# Vivado block design bram_lutwave, xczu28dr-ffvg1517-2-e, Vivado 2020.2
# (continued, part 2 of 4)
current_bd_instance /chan2

# ---- hierarchy /chan2/q_adc_splitter ----
current_bd_instance /chan2/q_adc_splitter
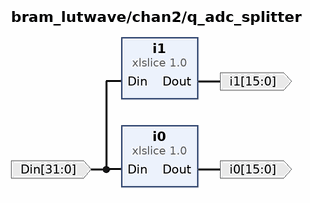
[diagram p13: block diagram inside /chan2/q_adc_splitter]
create_bd_pin -dir I -from 31 -to 0 Din
create_bd_pin -dir O -from 15 -to 0 i0
create_bd_pin -dir O -from 15 -to 0 i1

create_bd_cell -type ip -vlnv xilinx.com:ip:xlslice:1.0 i0
set_property -dict {CONFIG.DIN_FROM 15 CONFIG.DIN_TO 0 CONFIG.DIN_WIDTH 32 CONFIG.DOUT_WIDTH 16} [get_bd_cells i0]
create_bd_cell -type ip -vlnv xilinx.com:ip:xlslice:1.0 i1
set_property -dict {CONFIG.DIN_FROM 31 CONFIG.DIN_TO 16 CONFIG.DIN_WIDTH 32 CONFIG.DOUT_WIDTH 16} [get_bd_cells i1]

# ---- hierarchy /chan2/accum_sync ----
current_bd_instance /chan2/accum_sync
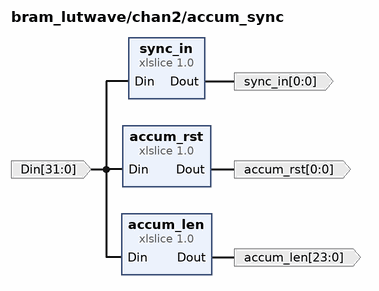
[diagram p14: block diagram inside /chan2/accum_sync]
create_bd_pin -dir I -from 31 -to 0 Din
create_bd_pin -dir O -from 23 -to 0 accum_len
create_bd_pin -dir O -from 0 -to 0 accum_rst
create_bd_pin -dir O -from 0 -to 0 sync_in

create_bd_cell -type ip -vlnv xilinx.com:ip:xlslice:1.0 accum_len
set_property -dict {CONFIG.DIN_FROM 23 CONFIG.DIN_TO 0 CONFIG.DIN_WIDTH 32 CONFIG.DOUT_WIDTH 24} [get_bd_cells accum_len]
create_bd_cell -type ip -vlnv xilinx.com:ip:xlslice:1.0 accum_rst
set_property -dict {CONFIG.DIN_FROM 24 CONFIG.DIN_TO 24 CONFIG.DIN_WIDTH 32 CONFIG.DOUT_WIDTH 1} [get_bd_cells accum_rst]
create_bd_cell -type ip -vlnv xilinx.com:ip:xlslice:1.0 sync_in
set_property -dict {CONFIG.DIN_FROM 26 CONFIG.DIN_TO 26 CONFIG.DIN_WIDTH 32 CONFIG.DOUT_WIDTH 1} [get_bd_cells sync_in]

# ---- hierarchy /chan2/i_adc_splitter ----
current_bd_instance /chan2/i_adc_splitter
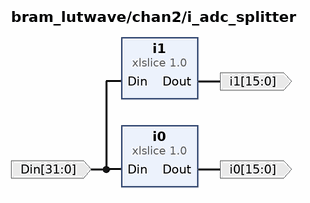
[diagram p15: block diagram inside /chan2/i_adc_splitter]
create_bd_pin -dir I -from 31 -to 0 Din
create_bd_pin -dir O -from 15 -to 0 i0
create_bd_pin -dir O -from 15 -to 0 i1

create_bd_cell -type ip -vlnv xilinx.com:ip:xlslice:1.0 i0
set_property -dict {CONFIG.DIN_FROM 15 CONFIG.DIN_TO 0 CONFIG.DIN_WIDTH 32 CONFIG.DOUT_WIDTH 16} [get_bd_cells i0]
create_bd_cell -type ip -vlnv xilinx.com:ip:xlslice:1.0 i1
set_property -dict {CONFIG.DIN_FROM 31 CONFIG.DIN_TO 16 CONFIG.DIN_WIDTH 32 CONFIG.DOUT_WIDTH 16} [get_bd_cells i1]

# ---- hierarchy /chan2/wide_bram ----
current_bd_instance /chan2/wide_bram
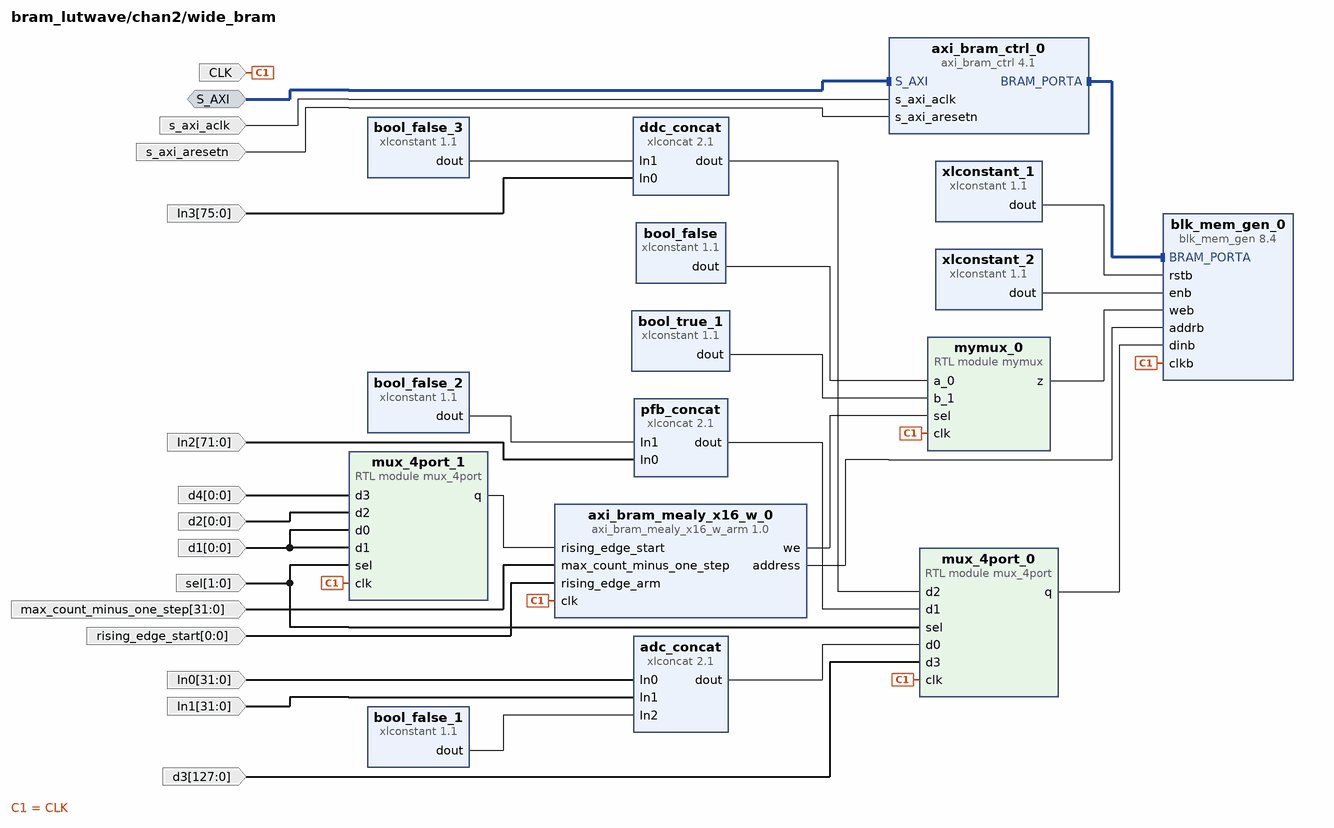
[diagram p16: block diagram inside /chan2/wide_bram]
create_bd_intf_pin -mode Slave -vlnv xilinx.com:interface:aximm_rtl:1.0 S_AXI
create_bd_pin -dir I -type clk s_axi_aclk
create_bd_pin -dir I -type rst s_axi_aresetn
create_bd_pin -dir I -type clk CLK
create_bd_pin -dir I -from 31 -to 0 -type data max_count_minus_one_step
create_bd_pin -dir I -from 0 -to 0 -type data rising_edge_start
create_bd_pin -dir I -from 1 -to 0 sel
create_bd_pin -dir I -from 31 -to 0 In0
create_bd_pin -dir I -from 31 -to 0 In1
create_bd_pin -dir I -from 71 -to 0 In2
create_bd_pin -dir I -from 75 -to 0 In3
create_bd_pin -dir I -from 127 -to 0 d3
create_bd_pin -dir I -from 0 -to 0 d4
create_bd_pin -dir I -from 0 -to 0 d2
create_bd_pin -dir I -from 0 -to 0 d1

create_bd_cell -type ip -vlnv xilinx.com:ip:axi_bram_ctrl:4.1 axi_bram_ctrl_0
set_property -dict {CONFIG.DATA_WIDTH 128 CONFIG.SINGLE_PORT_BRAM 1} [get_bd_cells axi_bram_ctrl_0]
create_bd_cell -type ip -vlnv xilinx.com:ip:xlconstant:1.1 xlconstant_1
set_property -dict {CONFIG.CONST_VAL 0} [get_bd_cells xlconstant_1]
create_bd_cell -type ip -vlnv xilinx.com:ip:xlconstant:1.1 xlconstant_2
set_property -dict {CONFIG.CONST_VAL 1} [get_bd_cells xlconstant_2]
create_bd_cell -type ip -vlnv xilinx.com:ip:blk_mem_gen:8.4 blk_mem_gen_0
set_property -dict [list \
  CONFIG.Enable_32bit_Address true \
  CONFIG.Memory_Type True_Dual_Port_RAM \
  CONFIG.PRIM_type_to_Implement URAM \
  CONFIG.Port_B_Clock 100 \
  CONFIG.Port_B_Enable_Rate 100 \
  CONFIG.Port_B_Write_Rate 50 \
  CONFIG.Use_RSTA_Pin true \
  CONFIG.Use_RSTB_Pin true \
  CONFIG.Write_Depth_A 2048 \
  CONFIG.Write_Width_A 128 \
  CONFIG.use_bram_block Stand_Alone \
] [get_bd_cells blk_mem_gen_0]
create_bd_cell -type ip -vlnv xilinx.com:ip:xlconstant:1.1 bool_false
set_property -dict {CONFIG.CONST_VAL 0 CONFIG.CONST_WIDTH 16} [get_bd_cells bool_false]
create_bd_cell -type ip -vlnv xilinx.com:ip:xlconstant:1.1 bool_true_1
set_property -dict {CONFIG.CONST_VAL 65535 CONFIG.CONST_WIDTH 16} [get_bd_cells bool_true_1]
create_bd_cell -type module -reference mux_4port mux_4port_0
create_bd_cell -type ip -vlnv xilinx.com:ip:xlconcat:2.1 adc_concat
set_property -dict {CONFIG.IN0_WIDTH 32 CONFIG.IN1_WIDTH 32 CONFIG.IN2_WIDTH 64 CONFIG.NUM_PORTS 3} [get_bd_cells adc_concat]
create_bd_cell -type ip -vlnv xilinx.com:ip:xlconstant:1.1 bool_false_1
set_property -dict {CONFIG.CONST_VAL 0 CONFIG.CONST_WIDTH 64} [get_bd_cells bool_false_1]
create_bd_cell -type ip -vlnv xilinx.com:ip:xlconcat:2.1 pfb_concat
set_property -dict {CONFIG.IN0_WIDTH 72 CONFIG.IN1_WIDTH 56 CONFIG.NUM_PORTS 2} [get_bd_cells pfb_concat]
create_bd_cell -type ip -vlnv xilinx.com:ip:xlconstant:1.1 bool_false_2
set_property -dict {CONFIG.CONST_VAL 0 CONFIG.CONST_WIDTH 56} [get_bd_cells bool_false_2]
create_bd_cell -type ip -vlnv xilinx.com:ip:xlconcat:2.1 ddc_concat
set_property -dict {CONFIG.IN0_WIDTH 76 CONFIG.IN1_WIDTH 52 CONFIG.NUM_PORTS 2} [get_bd_cells ddc_concat]
create_bd_cell -type ip -vlnv xilinx.com:ip:xlconstant:1.1 bool_false_3
set_property -dict {CONFIG.CONST_VAL 0 CONFIG.CONST_WIDTH 52} [get_bd_cells bool_false_3]
create_bd_cell -type module -reference mymux mymux_0
set_property -dict {CONFIG.width 16} [get_bd_cells mymux_0]
create_bd_cell -type ip -vlnv User_Company:SysGen:axi_bram_mealy_x16_w_arm:1.0 axi_bram_mealy_x16_w_0
create_bd_cell -type module -reference mux_4port mux_4port_1
set_property -dict {CONFIG.width 1} [get_bd_cells mux_4port_1]

# ---- hierarchy /chan2ts ----
current_bd_instance /chan2ts
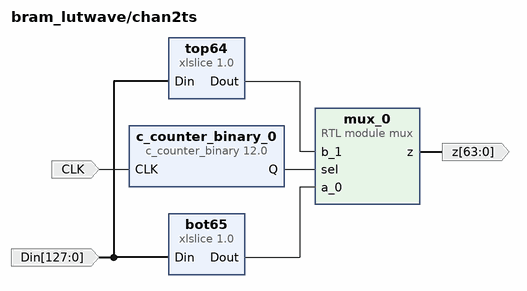
[diagram p17: block diagram inside /chan2ts]
create_bd_pin -dir I -from 127 -to 0 Din
create_bd_pin -dir O -from 63 -to 0 z
create_bd_pin -dir I -type clk CLK

create_bd_cell -type ip -vlnv xilinx.com:ip:xlslice:1.0 top64
set_property -dict {CONFIG.DIN_FROM 127 CONFIG.DIN_TO 64 CONFIG.DIN_WIDTH 128 CONFIG.DOUT_WIDTH 64} [get_bd_cells top64]
create_bd_cell -type module -reference mux mux_0
set_property -dict {CONFIG.width 64} [get_bd_cells mux_0]
create_bd_cell -type ip -vlnv xilinx.com:ip:c_counter_binary:12.0 c_counter_binary_0
set_property -dict {CONFIG.Output_Width 1} [get_bd_cells c_counter_binary_0]
create_bd_cell -type ip -vlnv xilinx.com:ip:xlslice:1.0 bot65
set_property -dict {CONFIG.DIN_FROM 63 CONFIG.DIN_TO 0 CONFIG.DIN_WIDTH 128 CONFIG.DOUT_WIDTH 64} [get_bd_cells bot65]

# ---- hierarchy /chan3ts ----
current_bd_instance /chan3ts
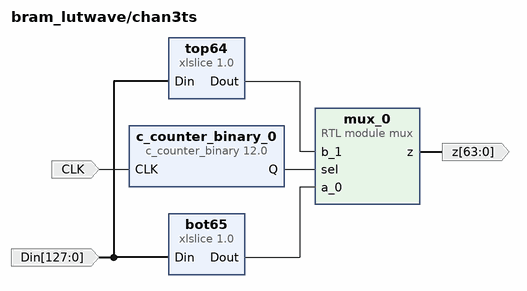
[diagram p18: block diagram inside /chan3ts]
create_bd_pin -dir I -from 127 -to 0 Din
create_bd_pin -dir O -from 63 -to 0 z
create_bd_pin -dir I -type clk CLK

create_bd_cell -type ip -vlnv xilinx.com:ip:xlslice:1.0 top64
set_property -dict {CONFIG.DIN_FROM 127 CONFIG.DIN_TO 64 CONFIG.DIN_WIDTH 128 CONFIG.DOUT_WIDTH 64} [get_bd_cells top64]
create_bd_cell -type module -reference mux mux_0
set_property -dict {CONFIG.width 64} [get_bd_cells mux_0]
create_bd_cell -type ip -vlnv xilinx.com:ip:c_counter_binary:12.0 c_counter_binary_0
set_property -dict {CONFIG.Output_Width 1} [get_bd_cells c_counter_binary_0]
create_bd_cell -type ip -vlnv xilinx.com:ip:xlslice:1.0 bot65
set_property -dict {CONFIG.DIN_FROM 63 CONFIG.DIN_TO 0 CONFIG.DIN_WIDTH 128 CONFIG.DOUT_WIDTH 64} [get_bd_cells bot65]

# ---- hierarchy /chan3ts1 ----
current_bd_instance /chan3ts1
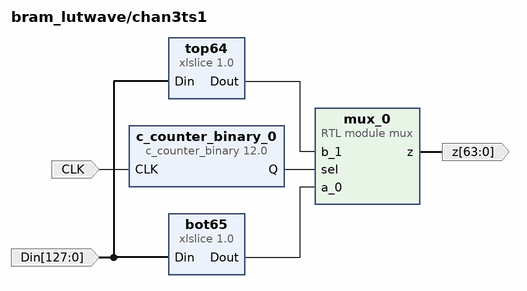
[diagram p19: block diagram inside /chan3ts1]
create_bd_pin -dir I -from 127 -to 0 Din
create_bd_pin -dir O -from 63 -to 0 z
create_bd_pin -dir I -type clk CLK

create_bd_cell -type ip -vlnv xilinx.com:ip:xlslice:1.0 top64
set_property -dict {CONFIG.DIN_FROM 127 CONFIG.DIN_TO 64 CONFIG.DIN_WIDTH 128 CONFIG.DOUT_WIDTH 64} [get_bd_cells top64]
create_bd_cell -type module -reference mux mux_0
set_property -dict {CONFIG.width 64} [get_bd_cells mux_0]
create_bd_cell -type ip -vlnv xilinx.com:ip:c_counter_binary:12.0 c_counter_binary_0
set_property -dict {CONFIG.Output_Width 1} [get_bd_cells c_counter_binary_0]
create_bd_cell -type ip -vlnv xilinx.com:ip:xlslice:1.0 bot65
set_property -dict {CONFIG.DIN_FROM 63 CONFIG.DIN_TO 0 CONFIG.DIN_WIDTH 128 CONFIG.DOUT_WIDTH 64} [get_bd_cells bot65]

# ---- hierarchy /chan3 ----
current_bd_instance /chan3
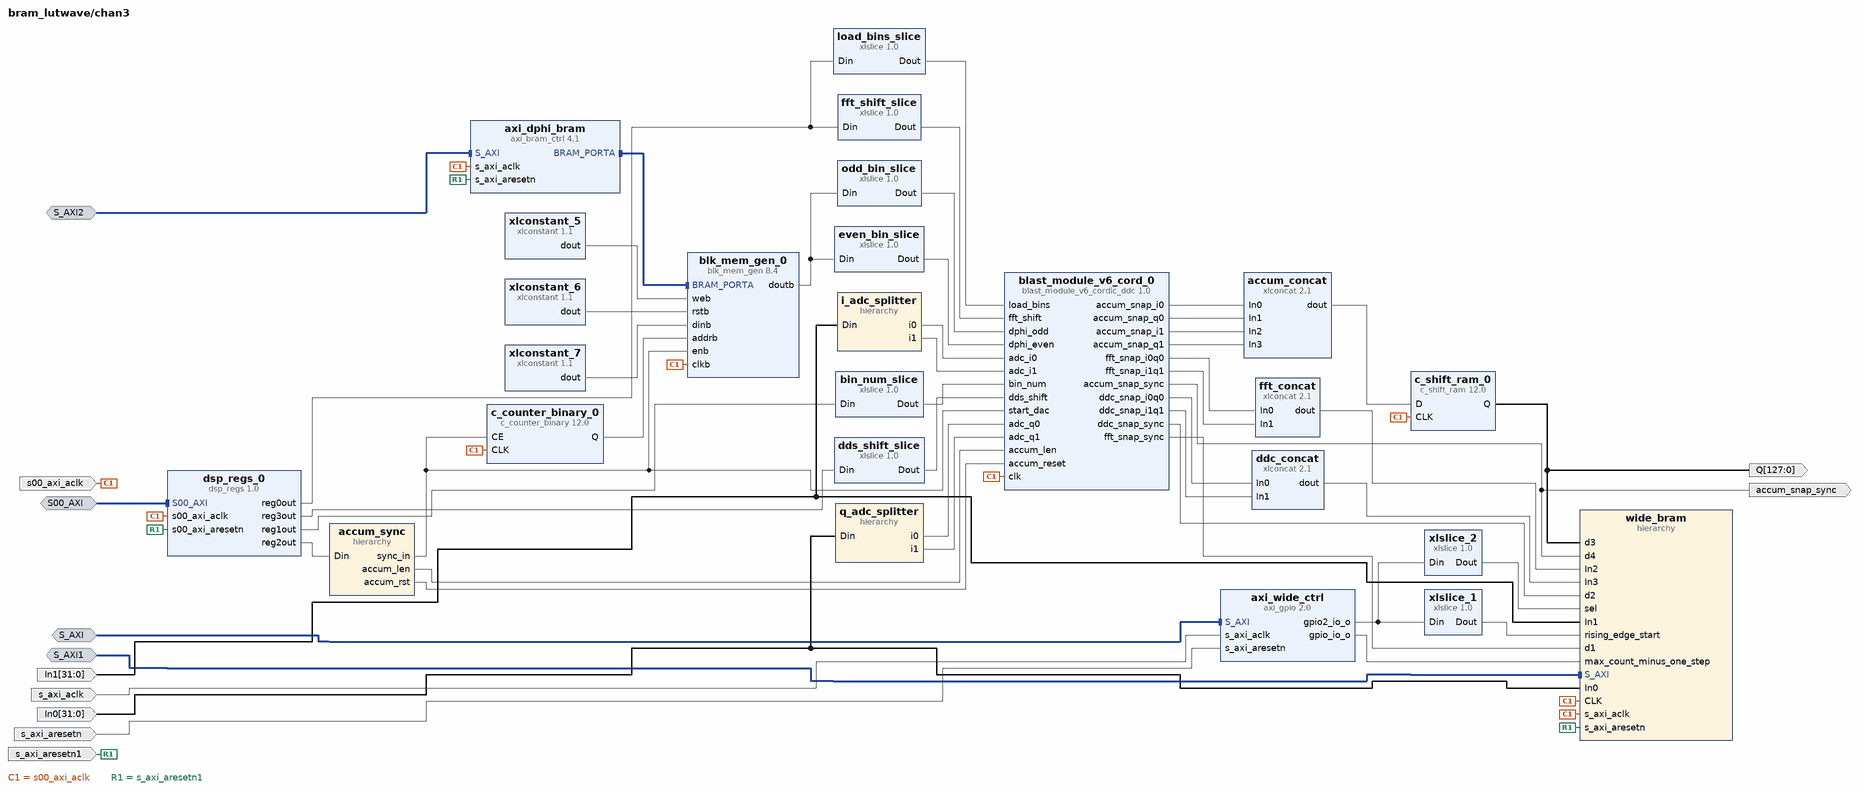
[diagram p20: block diagram inside /chan3]
create_bd_intf_pin -mode Slave -vlnv xilinx.com:interface:aximm_rtl:1.0 S_AXI
create_bd_intf_pin -mode Slave -vlnv xilinx.com:interface:aximm_rtl:1.0 S00_AXI
create_bd_intf_pin -mode Slave -vlnv xilinx.com:interface:aximm_rtl:1.0 S_AXI1
create_bd_intf_pin -mode Slave -vlnv xilinx.com:interface:aximm_rtl:1.0 S_AXI2
create_bd_pin -dir I -type clk s00_axi_aclk
create_bd_pin -dir I -type clk s_axi_aclk
create_bd_pin -dir I -type rst s_axi_aresetn
create_bd_pin -dir I -type rst s_axi_aresetn1
create_bd_pin -dir I -from 31 -to 0 In0
create_bd_pin -dir I -from 31 -to 0 In1
create_bd_pin -dir O -type data accum_snap_sync
create_bd_pin -dir O -from 127 -to 0 -type data Q

create_bd_cell -type ip -vlnv xilinx.com:ip:xlconcat:2.1 accum_concat
set_property -dict {CONFIG.NUM_PORTS 4 CONFIG.dout_width 128} [get_bd_cells accum_concat]
create_bd_cell -type ip -vlnv xilinx.com:ip:xlslice:1.0 xlslice_1
create_bd_cell -type ip -vlnv xilinx.com:ip:xlslice:1.0 xlslice_2
set_property -dict {CONFIG.DIN_FROM 2 CONFIG.DIN_TO 1 CONFIG.DOUT_WIDTH 2} [get_bd_cells xlslice_2]
create_bd_cell -type ip -vlnv xilinx.com:ip:xlslice:1.0 dds_shift_slice
set_property -dict {CONFIG.DIN_FROM 8 CONFIG.DIN_TO 0 CONFIG.DIN_WIDTH 32 CONFIG.DOUT_WIDTH 9} [get_bd_cells dds_shift_slice]
create_bd_cell -type ip -vlnv xilinx.com:ip:xlconcat:2.1 ddc_concat
set_property -dict {CONFIG.NUM_PORTS 2 CONFIG.dout_width 76} [get_bd_cells ddc_concat]
create_bd_cell -type ip -vlnv xilinx.com:ip:xlslice:1.0 load_bins_slice
set_property -dict {CONFIG.DIN_FROM 22 CONFIG.DIN_TO 12 CONFIG.DIN_WIDTH 32 CONFIG.DOUT_WIDTH 11} [get_bd_cells load_bins_slice]
create_bd_cell -type ip -vlnv xilinx.com:ip:axi_gpio:2.0 axi_wide_ctrl
set_property -dict {CONFIG.C_ALL_OUTPUTS 1 CONFIG.C_ALL_OUTPUTS_2 1 CONFIG.C_IS_DUAL 1} [get_bd_cells axi_wide_ctrl]
create_bd_cell -type ip -vlnv xilinx.com:ip:xlconcat:2.1 fft_concat
set_property -dict {CONFIG.NUM_PORTS 2 CONFIG.dout_width 72} [get_bd_cells fft_concat]
create_bd_cell -type ip -vlnv xilinx.com:ip:xlslice:1.0 fft_shift_slice
set_property -dict {CONFIG.DIN_FROM 9 CONFIG.DIN_TO 0 CONFIG.DIN_WIDTH 32 CONFIG.DOUT_WIDTH 10} [get_bd_cells fft_shift_slice]
create_bd_cell -type ip -vlnv xilinx.com:ip:xlslice:1.0 bin_num_slice
set_property -dict {CONFIG.DIN_FROM 9 CONFIG.DIN_TO 0 CONFIG.DIN_WIDTH 32 CONFIG.DOUT_WIDTH 10} [get_bd_cells bin_num_slice]
create_bd_cell -type ip -vlnv user.org:user:dsp_regs:1.0 dsp_regs_0
create_bd_cell -type hier q_adc_splitter
create_bd_cell -type hier accum_sync
create_bd_cell -type hier i_adc_splitter
create_bd_cell -type hier wide_bram
create_bd_cell -type ip -vlnv xilinx.com:ip:axi_bram_ctrl:4.1 axi_dphi_bram
set_property -dict {CONFIG.DATA_WIDTH 32 CONFIG.SINGLE_PORT_BRAM 1} [get_bd_cells axi_dphi_bram]
create_bd_cell -type ip -vlnv xilinx.com:ip:blk_mem_gen:8.4 blk_mem_gen_0
set_property -dict [list \
  CONFIG.Assume_Synchronous_Clk false \
  CONFIG.EN_SAFETY_CKT true \
  CONFIG.Enable_32bit_Address true \
  CONFIG.Enable_B Use_ENB_Pin \
  CONFIG.Memory_Type True_Dual_Port_RAM \
  CONFIG.Operating_Mode_A WRITE_FIRST \
  CONFIG.Operating_Mode_B WRITE_FIRST \
  CONFIG.PRIM_type_to_Implement BRAM \
  CONFIG.Port_B_Clock 100 \
  CONFIG.Port_B_Enable_Rate 100 \
  CONFIG.Port_B_Write_Rate 50 \
  CONFIG.Read_Width_A 32 \
  CONFIG.Read_Width_B 32 \
  CONFIG.Register_PortA_Output_of_Memory_Primitives true \
  CONFIG.Register_PortB_Output_of_Memory_Primitives true \
  CONFIG.Use_RSTA_Pin true \
  CONFIG.Use_RSTB_Pin true \
  CONFIG.Write_Depth_A 512 \
  CONFIG.Write_Width_A 32 \
  CONFIG.Write_Width_B 32 \
  CONFIG.use_bram_block Stand_Alone \
] [get_bd_cells blk_mem_gen_0]
create_bd_cell -type ip -vlnv xilinx.com:ip:c_counter_binary:12.0 c_counter_binary_0
set_property -dict [list \
  CONFIG.CE true \
  CONFIG.Final_Count_Value 7ff \
  CONFIG.Increment_Value 4 \
  CONFIG.Output_Width 32 \
  CONFIG.Restrict_Count true \
] [get_bd_cells c_counter_binary_0]
create_bd_cell -type ip -vlnv xilinx.com:ip:xlconstant:1.1 xlconstant_5
set_property -dict {CONFIG.CONST_VAL 0 CONFIG.CONST_WIDTH 4} [get_bd_cells xlconstant_5]
create_bd_cell -type ip -vlnv xilinx.com:ip:xlslice:1.0 even_bin_slice
set_property -dict {CONFIG.DIN_FROM 15 CONFIG.DIN_TO 0 CONFIG.DIN_WIDTH 32 CONFIG.DOUT_WIDTH 16} [get_bd_cells even_bin_slice]
create_bd_cell -type ip -vlnv xilinx.com:ip:xlslice:1.0 odd_bin_slice
set_property -dict {CONFIG.DIN_FROM 31 CONFIG.DIN_TO 16 CONFIG.DIN_WIDTH 32 CONFIG.DOUT_WIDTH 16} [get_bd_cells odd_bin_slice]
create_bd_cell -type ip -vlnv xilinx.com:ip:xlconstant:1.1 xlconstant_6
set_property -dict {CONFIG.CONST_VAL 0 CONFIG.CONST_WIDTH 1} [get_bd_cells xlconstant_6]
create_bd_cell -type ip -vlnv xilinx.com:ip:xlconstant:1.1 xlconstant_7
set_property -dict {CONFIG.CONST_VAL 0 CONFIG.CONST_WIDTH 32} [get_bd_cells xlconstant_7]
create_bd_cell -type ip -vlnv User_Company:SysGen:blast_module_v6_cordic_ddc:1.0 blast_module_v6_cord_0
create_bd_cell -type ip -vlnv xilinx.com:ip:c_shift_ram:12.0 c_shift_ram_0
set_property -dict [list \
  CONFIG.AsyncInitVal 00000000000000000000000000000000000000000000000000000000000000000000000000000000000000000000000000000000000000000000000000000000 \
  CONFIG.DefaultData 00000000000000000000000000000000000000000000000000000000000000000000000000000000000000000000000000000000000000000000000000000000 \
  CONFIG.Depth 4 \
  CONFIG.Width 128 \
] [get_bd_cells c_shift_ram_0]

# ---- hierarchy /chan3/q_adc_splitter ----
current_bd_instance /chan3/q_adc_splitter
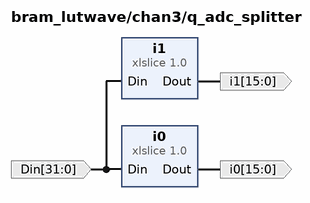
[diagram p21: block diagram inside /chan3/q_adc_splitter]
create_bd_pin -dir I -from 31 -to 0 Din
create_bd_pin -dir O -from 15 -to 0 i0
create_bd_pin -dir O -from 15 -to 0 i1

create_bd_cell -type ip -vlnv xilinx.com:ip:xlslice:1.0 i0
set_property -dict {CONFIG.DIN_FROM 15 CONFIG.DIN_TO 0 CONFIG.DIN_WIDTH 32 CONFIG.DOUT_WIDTH 16} [get_bd_cells i0]
create_bd_cell -type ip -vlnv xilinx.com:ip:xlslice:1.0 i1
set_property -dict {CONFIG.DIN_FROM 31 CONFIG.DIN_TO 16 CONFIG.DIN_WIDTH 32 CONFIG.DOUT_WIDTH 16} [get_bd_cells i1]

# ---- hierarchy /chan3/accum_sync ----
current_bd_instance /chan3/accum_sync
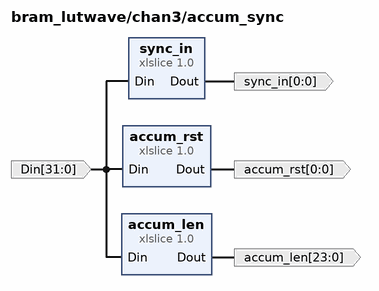
[diagram p22: block diagram inside /chan3/accum_sync]
create_bd_pin -dir I -from 31 -to 0 Din
create_bd_pin -dir O -from 23 -to 0 accum_len
create_bd_pin -dir O -from 0 -to 0 accum_rst
create_bd_pin -dir O -from 0 -to 0 sync_in

create_bd_cell -type ip -vlnv xilinx.com:ip:xlslice:1.0 accum_len
set_property -dict {CONFIG.DIN_FROM 23 CONFIG.DIN_TO 0 CONFIG.DIN_WIDTH 32 CONFIG.DOUT_WIDTH 24} [get_bd_cells accum_len]
create_bd_cell -type ip -vlnv xilinx.com:ip:xlslice:1.0 accum_rst
set_property -dict {CONFIG.DIN_FROM 24 CONFIG.DIN_TO 24 CONFIG.DIN_WIDTH 32 CONFIG.DOUT_WIDTH 1} [get_bd_cells accum_rst]
create_bd_cell -type ip -vlnv xilinx.com:ip:xlslice:1.0 sync_in
set_property -dict {CONFIG.DIN_FROM 26 CONFIG.DIN_TO 26 CONFIG.DIN_WIDTH 32 CONFIG.DOUT_WIDTH 1} [get_bd_cells sync_in]

# ---- hierarchy /chan3/i_adc_splitter ----
current_bd_instance /chan3/i_adc_splitter
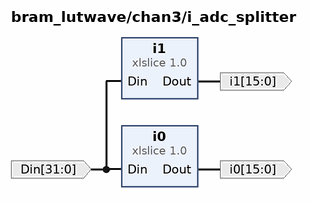
[diagram p23: block diagram inside /chan3/i_adc_splitter]
create_bd_pin -dir I -from 31 -to 0 Din
create_bd_pin -dir O -from 15 -to 0 i0
create_bd_pin -dir O -from 15 -to 0 i1

create_bd_cell -type ip -vlnv xilinx.com:ip:xlslice:1.0 i0
set_property -dict {CONFIG.DIN_FROM 15 CONFIG.DIN_TO 0 CONFIG.DIN_WIDTH 32 CONFIG.DOUT_WIDTH 16} [get_bd_cells i0]
create_bd_cell -type ip -vlnv xilinx.com:ip:xlslice:1.0 i1
set_property -dict {CONFIG.DIN_FROM 31 CONFIG.DIN_TO 16 CONFIG.DIN_WIDTH 32 CONFIG.DOUT_WIDTH 16} [get_bd_cells i1]

# ---- hierarchy /chan3/wide_bram ----
current_bd_instance /chan3/wide_bram
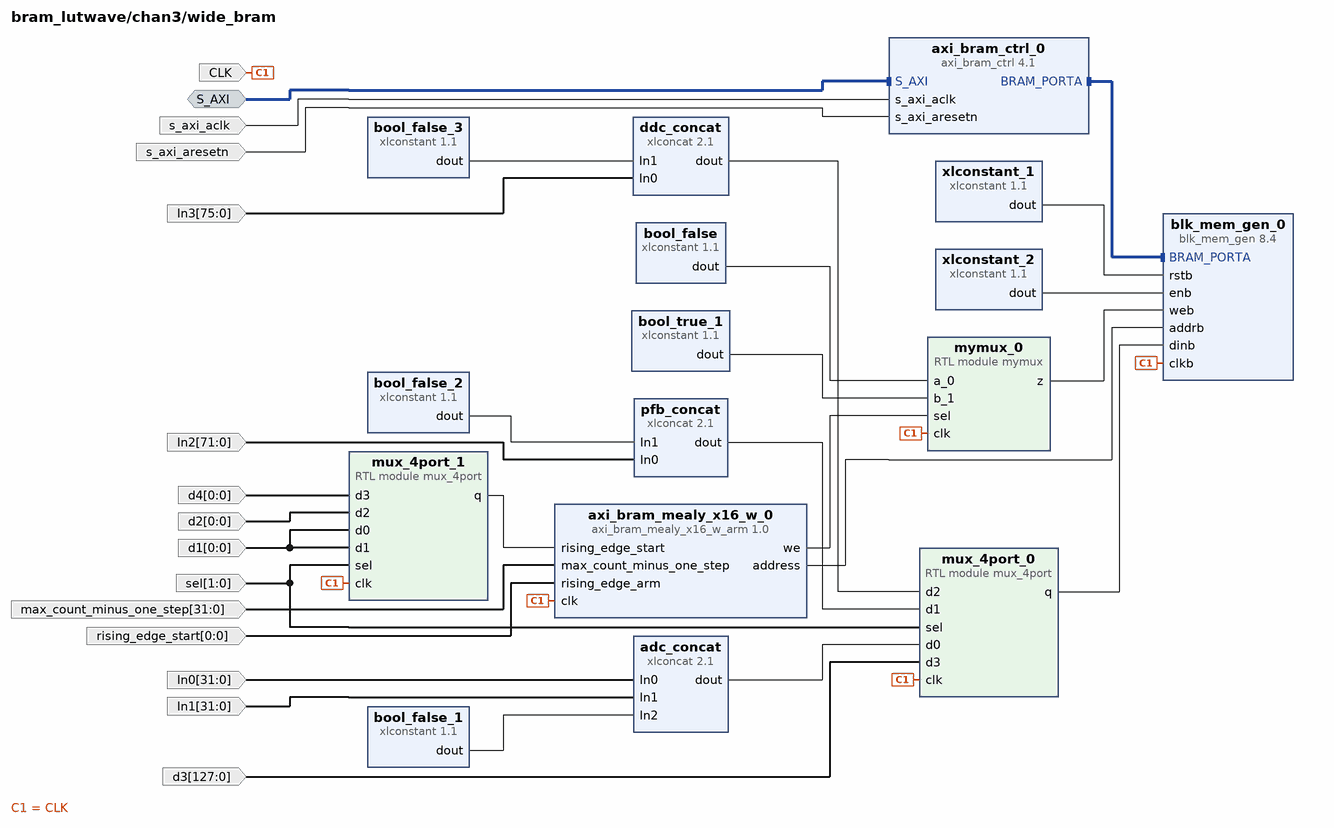
[diagram p24: block diagram inside /chan3/wide_bram]
create_bd_intf_pin -mode Slave -vlnv xilinx.com:interface:aximm_rtl:1.0 S_AXI
create_bd_pin -dir I -type clk s_axi_aclk
create_bd_pin -dir I -type rst s_axi_aresetn
create_bd_pin -dir I -type clk CLK
create_bd_pin -dir I -from 31 -to 0 -type data max_count_minus_one_step
create_bd_pin -dir I -from 0 -to 0 -type data rising_edge_start
create_bd_pin -dir I -from 1 -to 0 sel
create_bd_pin -dir I -from 31 -to 0 In0
create_bd_pin -dir I -from 31 -to 0 In1
create_bd_pin -dir I -from 71 -to 0 In2
create_bd_pin -dir I -from 75 -to 0 In3
create_bd_pin -dir I -from 127 -to 0 d3
create_bd_pin -dir I -from 0 -to 0 d4
create_bd_pin -dir I -from 0 -to 0 d2
create_bd_pin -dir I -from 0 -to 0 d1

create_bd_cell -type ip -vlnv xilinx.com:ip:axi_bram_ctrl:4.1 axi_bram_ctrl_0
set_property -dict {CONFIG.DATA_WIDTH 128 CONFIG.SINGLE_PORT_BRAM 1} [get_bd_cells axi_bram_ctrl_0]
create_bd_cell -type ip -vlnv xilinx.com:ip:xlconstant:1.1 xlconstant_1
set_property -dict {CONFIG.CONST_VAL 0} [get_bd_cells xlconstant_1]
create_bd_cell -type ip -vlnv xilinx.com:ip:xlconstant:1.1 xlconstant_2
set_property -dict {CONFIG.CONST_VAL 1} [get_bd_cells xlconstant_2]
create_bd_cell -type ip -vlnv xilinx.com:ip:blk_mem_gen:8.4 blk_mem_gen_0
set_property -dict [list \
  CONFIG.Enable_32bit_Address true \
  CONFIG.Memory_Type True_Dual_Port_RAM \
  CONFIG.PRIM_type_to_Implement URAM \
  CONFIG.Port_B_Clock 100 \
  CONFIG.Port_B_Enable_Rate 100 \
  CONFIG.Port_B_Write_Rate 50 \
  CONFIG.Use_RSTA_Pin true \
  CONFIG.Use_RSTB_Pin true \
  CONFIG.Write_Depth_A 2048 \
  CONFIG.Write_Width_A 128 \
  CONFIG.use_bram_block Stand_Alone \
] [get_bd_cells blk_mem_gen_0]
create_bd_cell -type ip -vlnv xilinx.com:ip:xlconstant:1.1 bool_false
set_property -dict {CONFIG.CONST_VAL 0 CONFIG.CONST_WIDTH 16} [get_bd_cells bool_false]
create_bd_cell -type ip -vlnv xilinx.com:ip:xlconstant:1.1 bool_true_1
set_property -dict {CONFIG.CONST_VAL 65535 CONFIG.CONST_WIDTH 16} [get_bd_cells bool_true_1]
create_bd_cell -type module -reference mux_4port mux_4port_0
create_bd_cell -type ip -vlnv xilinx.com:ip:xlconcat:2.1 adc_concat
set_property -dict {CONFIG.IN0_WIDTH 32 CONFIG.IN1_WIDTH 32 CONFIG.IN2_WIDTH 64 CONFIG.NUM_PORTS 3} [get_bd_cells adc_concat]
create_bd_cell -type ip -vlnv xilinx.com:ip:xlconstant:1.1 bool_false_1
set_property -dict {CONFIG.CONST_VAL 0 CONFIG.CONST_WIDTH 64} [get_bd_cells bool_false_1]
create_bd_cell -type ip -vlnv xilinx.com:ip:xlconcat:2.1 pfb_concat
set_property -dict {CONFIG.IN0_WIDTH 72 CONFIG.IN1_WIDTH 56 CONFIG.NUM_PORTS 2} [get_bd_cells pfb_concat]
create_bd_cell -type ip -vlnv xilinx.com:ip:xlconstant:1.1 bool_false_2
set_property -dict {CONFIG.CONST_VAL 0 CONFIG.CONST_WIDTH 56} [get_bd_cells bool_false_2]
create_bd_cell -type ip -vlnv xilinx.com:ip:xlconcat:2.1 ddc_concat
set_property -dict {CONFIG.IN0_WIDTH 76 CONFIG.IN1_WIDTH 52 CONFIG.NUM_PORTS 2} [get_bd_cells ddc_concat]
create_bd_cell -type ip -vlnv xilinx.com:ip:xlconstant:1.1 bool_false_3
set_property -dict {CONFIG.CONST_VAL 0 CONFIG.CONST_WIDTH 52} [get_bd_cells bool_false_3]
create_bd_cell -type module -reference mymux mymux_0
set_property -dict {CONFIG.width 16} [get_bd_cells mymux_0]
create_bd_cell -type ip -vlnv User_Company:SysGen:axi_bram_mealy_x16_w_arm:1.0 axi_bram_mealy_x16_w_0
create_bd_cell -type module -reference mux_4port mux_4port_1
set_property -dict {CONFIG.width 1} [get_bd_cells mux_4port_1]

# ---- hierarchy /chan4 ----
current_bd_instance /chan4
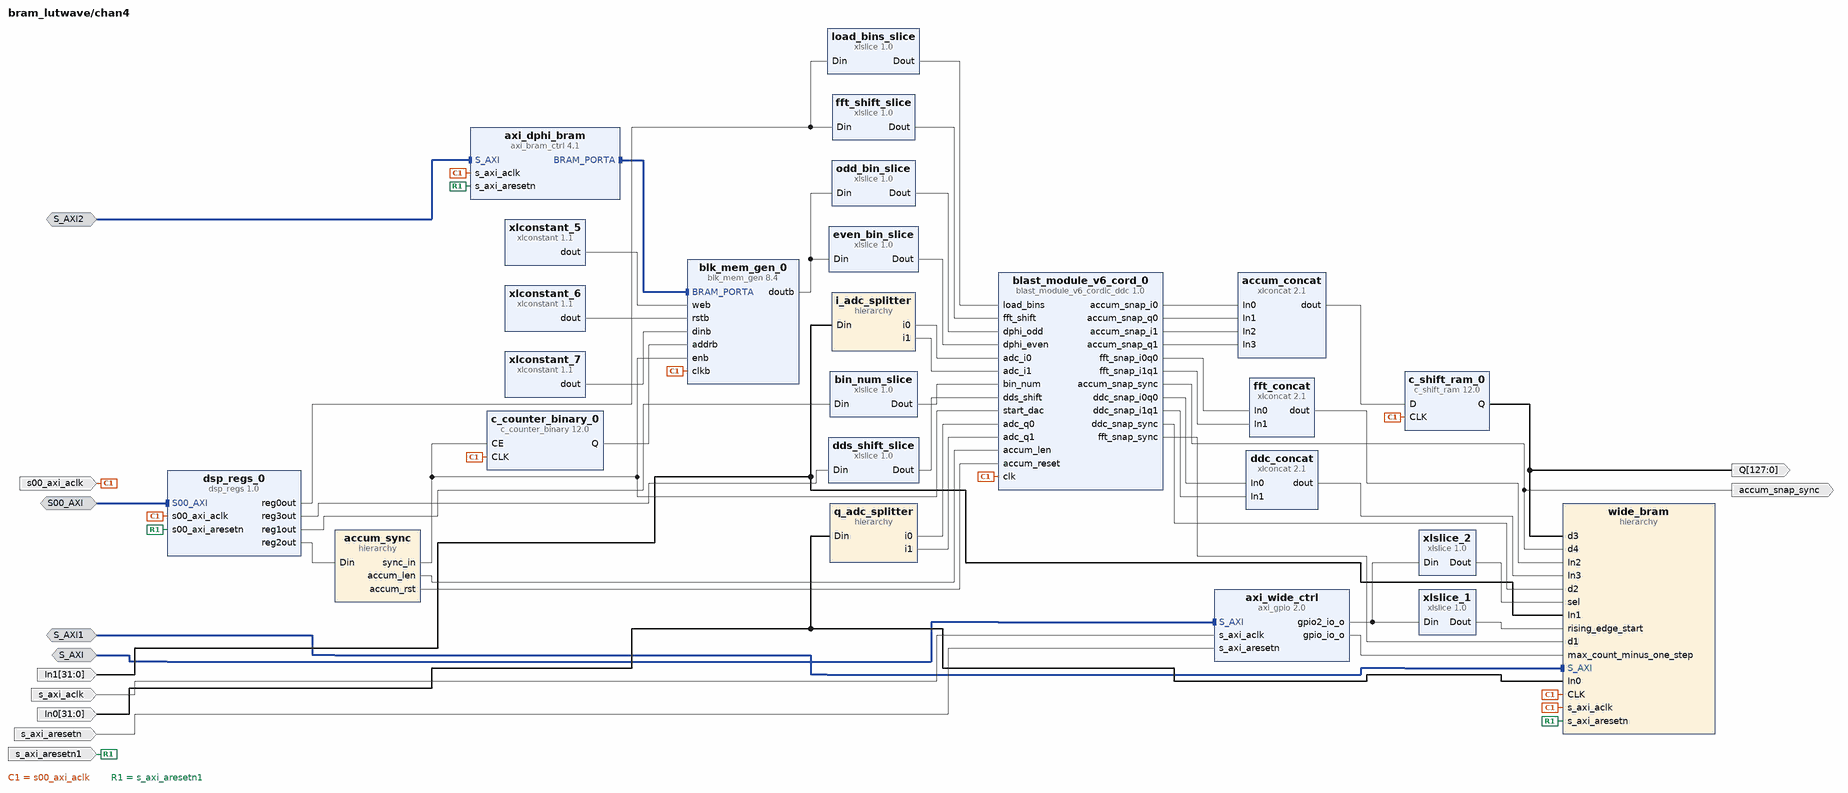
[diagram p25: block diagram inside /chan4]
create_bd_intf_pin -mode Slave -vlnv xilinx.com:interface:aximm_rtl:1.0 S_AXI
create_bd_intf_pin -mode Slave -vlnv xilinx.com:interface:aximm_rtl:1.0 S00_AXI
create_bd_intf_pin -mode Slave -vlnv xilinx.com:interface:aximm_rtl:1.0 S_AXI1
create_bd_intf_pin -mode Slave -vlnv xilinx.com:interface:aximm_rtl:1.0 S_AXI2
create_bd_pin -dir I -type clk s00_axi_aclk
create_bd_pin -dir I -type clk s_axi_aclk
create_bd_pin -dir I -type rst s_axi_aresetn
create_bd_pin -dir I -type rst s_axi_aresetn1
create_bd_pin -dir I -from 31 -to 0 In0
create_bd_pin -dir I -from 31 -to 0 In1
create_bd_pin -dir O -type data accum_snap_sync
create_bd_pin -dir O -from 127 -to 0 -type data Q

create_bd_cell -type ip -vlnv xilinx.com:ip:xlconcat:2.1 accum_concat
set_property -dict {CONFIG.NUM_PORTS 4 CONFIG.dout_width 128} [get_bd_cells accum_concat]
create_bd_cell -type ip -vlnv xilinx.com:ip:xlslice:1.0 xlslice_1
create_bd_cell -type ip -vlnv xilinx.com:ip:xlslice:1.0 xlslice_2
set_property -dict {CONFIG.DIN_FROM 2 CONFIG.DIN_TO 1 CONFIG.DOUT_WIDTH 2} [get_bd_cells xlslice_2]
create_bd_cell -type ip -vlnv xilinx.com:ip:xlslice:1.0 dds_shift_slice
set_property -dict {CONFIG.DIN_FROM 8 CONFIG.DIN_TO 0 CONFIG.DIN_WIDTH 32 CONFIG.DOUT_WIDTH 9} [get_bd_cells dds_shift_slice]
create_bd_cell -type ip -vlnv xilinx.com:ip:xlconcat:2.1 ddc_concat
set_property -dict {CONFIG.NUM_PORTS 2 CONFIG.dout_width 76} [get_bd_cells ddc_concat]
create_bd_cell -type ip -vlnv xilinx.com:ip:xlslice:1.0 load_bins_slice
set_property -dict {CONFIG.DIN_FROM 22 CONFIG.DIN_TO 12 CONFIG.DIN_WIDTH 32 CONFIG.DOUT_WIDTH 11} [get_bd_cells load_bins_slice]
create_bd_cell -type ip -vlnv xilinx.com:ip:axi_gpio:2.0 axi_wide_ctrl
set_property -dict {CONFIG.C_ALL_OUTPUTS 1 CONFIG.C_ALL_OUTPUTS_2 1 CONFIG.C_IS_DUAL 1} [get_bd_cells axi_wide_ctrl]
create_bd_cell -type ip -vlnv xilinx.com:ip:xlconcat:2.1 fft_concat
set_property -dict {CONFIG.NUM_PORTS 2 CONFIG.dout_width 72} [get_bd_cells fft_concat]
create_bd_cell -type ip -vlnv xilinx.com:ip:xlslice:1.0 fft_shift_slice
set_property -dict {CONFIG.DIN_FROM 9 CONFIG.DIN_TO 0 CONFIG.DIN_WIDTH 32 CONFIG.DOUT_WIDTH 10} [get_bd_cells fft_shift_slice]
create_bd_cell -type ip -vlnv xilinx.com:ip:xlslice:1.0 bin_num_slice
set_property -dict {CONFIG.DIN_FROM 9 CONFIG.DIN_TO 0 CONFIG.DIN_WIDTH 32 CONFIG.DOUT_WIDTH 10} [get_bd_cells bin_num_slice]
create_bd_cell -type ip -vlnv user.org:user:dsp_regs:1.0 dsp_regs_0
create_bd_cell -type hier q_adc_splitter
create_bd_cell -type hier accum_sync
create_bd_cell -type hier i_adc_splitter
create_bd_cell -type hier wide_bram
create_bd_cell -type ip -vlnv xilinx.com:ip:axi_bram_ctrl:4.1 axi_dphi_bram
set_property -dict {CONFIG.DATA_WIDTH 32 CONFIG.SINGLE_PORT_BRAM 1} [get_bd_cells axi_dphi_bram]
create_bd_cell -type ip -vlnv xilinx.com:ip:blk_mem_gen:8.4 blk_mem_gen_0
set_property -dict [list \
  CONFIG.Assume_Synchronous_Clk false \
  CONFIG.EN_SAFETY_CKT true \
  CONFIG.Enable_32bit_Address true \
  CONFIG.Enable_B Use_ENB_Pin \
  CONFIG.Memory_Type True_Dual_Port_RAM \
  CONFIG.Operating_Mode_A WRITE_FIRST \
  CONFIG.Operating_Mode_B WRITE_FIRST \
  CONFIG.PRIM_type_to_Implement BRAM \
  CONFIG.Port_B_Clock 100 \
  CONFIG.Port_B_Enable_Rate 100 \
  CONFIG.Port_B_Write_Rate 50 \
  CONFIG.Read_Width_A 32 \
  CONFIG.Read_Width_B 32 \
  CONFIG.Register_PortA_Output_of_Memory_Primitives true \
  CONFIG.Register_PortB_Output_of_Memory_Primitives true \
  CONFIG.Use_RSTA_Pin true \
  CONFIG.Use_RSTB_Pin true \
  CONFIG.Write_Depth_A 512 \
  CONFIG.Write_Width_A 32 \
  CONFIG.Write_Width_B 32 \
  CONFIG.use_bram_block Stand_Alone \
] [get_bd_cells blk_mem_gen_0]
create_bd_cell -type ip -vlnv xilinx.com:ip:c_counter_binary:12.0 c_counter_binary_0
set_property -dict [list \
  CONFIG.CE true \
  CONFIG.Final_Count_Value 7ff \
  CONFIG.Increment_Value 4 \
  CONFIG.Output_Width 32 \
  CONFIG.Restrict_Count true \
] [get_bd_cells c_counter_binary_0]
create_bd_cell -type ip -vlnv xilinx.com:ip:xlconstant:1.1 xlconstant_5
set_property -dict {CONFIG.CONST_VAL 0 CONFIG.CONST_WIDTH 4} [get_bd_cells xlconstant_5]
create_bd_cell -type ip -vlnv xilinx.com:ip:xlslice:1.0 even_bin_slice
set_property -dict {CONFIG.DIN_FROM 15 CONFIG.DIN_TO 0 CONFIG.DIN_WIDTH 32 CONFIG.DOUT_WIDTH 16} [get_bd_cells even_bin_slice]
create_bd_cell -type ip -vlnv xilinx.com:ip:xlslice:1.0 odd_bin_slice
set_property -dict {CONFIG.DIN_FROM 31 CONFIG.DIN_TO 16 CONFIG.DIN_WIDTH 32 CONFIG.DOUT_WIDTH 16} [get_bd_cells odd_bin_slice]
create_bd_cell -type ip -vlnv xilinx.com:ip:xlconstant:1.1 xlconstant_6
set_property -dict {CONFIG.CONST_VAL 0 CONFIG.CONST_WIDTH 1} [get_bd_cells xlconstant_6]
create_bd_cell -type ip -vlnv xilinx.com:ip:xlconstant:1.1 xlconstant_7
set_property -dict {CONFIG.CONST_VAL 0 CONFIG.CONST_WIDTH 32} [get_bd_cells xlconstant_7]
create_bd_cell -type ip -vlnv User_Company:SysGen:blast_module_v6_cordic_ddc:1.0 blast_module_v6_cord_0
create_bd_cell -type ip -vlnv xilinx.com:ip:c_shift_ram:12.0 c_shift_ram_0
set_property -dict [list \
  CONFIG.AsyncInitVal 00000000000000000000000000000000000000000000000000000000000000000000000000000000000000000000000000000000000000000000000000000000 \
  CONFIG.DefaultData 00000000000000000000000000000000000000000000000000000000000000000000000000000000000000000000000000000000000000000000000000000000 \
  CONFIG.Depth 4 \
  CONFIG.Width 128 \
] [get_bd_cells c_shift_ram_0]

# ---- hierarchy /chan4/q_adc_splitter ----
current_bd_instance /chan4/q_adc_splitter
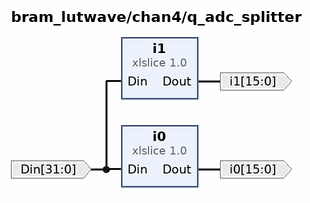
[diagram p26: block diagram inside /chan4/q_adc_splitter]
create_bd_pin -dir I -from 31 -to 0 Din
create_bd_pin -dir O -from 15 -to 0 i0
create_bd_pin -dir O -from 15 -to 0 i1

create_bd_cell -type ip -vlnv xilinx.com:ip:xlslice:1.0 i0
set_property -dict {CONFIG.DIN_FROM 15 CONFIG.DIN_TO 0 CONFIG.DIN_WIDTH 32 CONFIG.DOUT_WIDTH 16} [get_bd_cells i0]
create_bd_cell -type ip -vlnv xilinx.com:ip:xlslice:1.0 i1
set_property -dict {CONFIG.DIN_FROM 31 CONFIG.DIN_TO 16 CONFIG.DIN_WIDTH 32 CONFIG.DOUT_WIDTH 16} [get_bd_cells i1]

# ---- hierarchy /chan4/accum_sync ----
current_bd_instance /chan4/accum_sync
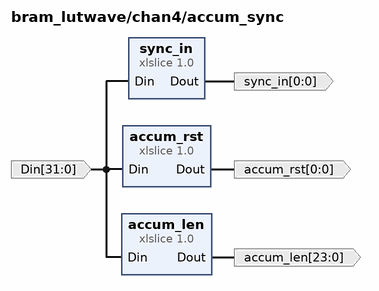
[diagram p27: block diagram inside /chan4/accum_sync]
create_bd_pin -dir I -from 31 -to 0 Din
create_bd_pin -dir O -from 23 -to 0 accum_len
create_bd_pin -dir O -from 0 -to 0 accum_rst
create_bd_pin -dir O -from 0 -to 0 sync_in

create_bd_cell -type ip -vlnv xilinx.com:ip:xlslice:1.0 accum_len
set_property -dict {CONFIG.DIN_FROM 23 CONFIG.DIN_TO 0 CONFIG.DIN_WIDTH 32 CONFIG.DOUT_WIDTH 24} [get_bd_cells accum_len]
create_bd_cell -type ip -vlnv xilinx.com:ip:xlslice:1.0 accum_rst
set_property -dict {CONFIG.DIN_FROM 24 CONFIG.DIN_TO 24 CONFIG.DIN_WIDTH 32 CONFIG.DOUT_WIDTH 1} [get_bd_cells accum_rst]
create_bd_cell -type ip -vlnv xilinx.com:ip:xlslice:1.0 sync_in
set_property -dict {CONFIG.DIN_FROM 26 CONFIG.DIN_TO 26 CONFIG.DIN_WIDTH 32 CONFIG.DOUT_WIDTH 1} [get_bd_cells sync_in]

# ---- hierarchy /chan4/i_adc_splitter ----
current_bd_instance /chan4/i_adc_splitter
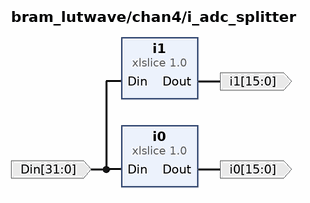
[diagram p28: block diagram inside /chan4/i_adc_splitter]
create_bd_pin -dir I -from 31 -to 0 Din
create_bd_pin -dir O -from 15 -to 0 i0
create_bd_pin -dir O -from 15 -to 0 i1

create_bd_cell -type ip -vlnv xilinx.com:ip:xlslice:1.0 i0
set_property -dict {CONFIG.DIN_FROM 15 CONFIG.DIN_TO 0 CONFIG.DIN_WIDTH 32 CONFIG.DOUT_WIDTH 16} [get_bd_cells i0]
create_bd_cell -type ip -vlnv xilinx.com:ip:xlslice:1.0 i1
set_property -dict {CONFIG.DIN_FROM 31 CONFIG.DIN_TO 16 CONFIG.DIN_WIDTH 32 CONFIG.DOUT_WIDTH 16} [get_bd_cells i1]

# ---- hierarchy /chan4/wide_bram ----
current_bd_instance /chan4/wide_bram
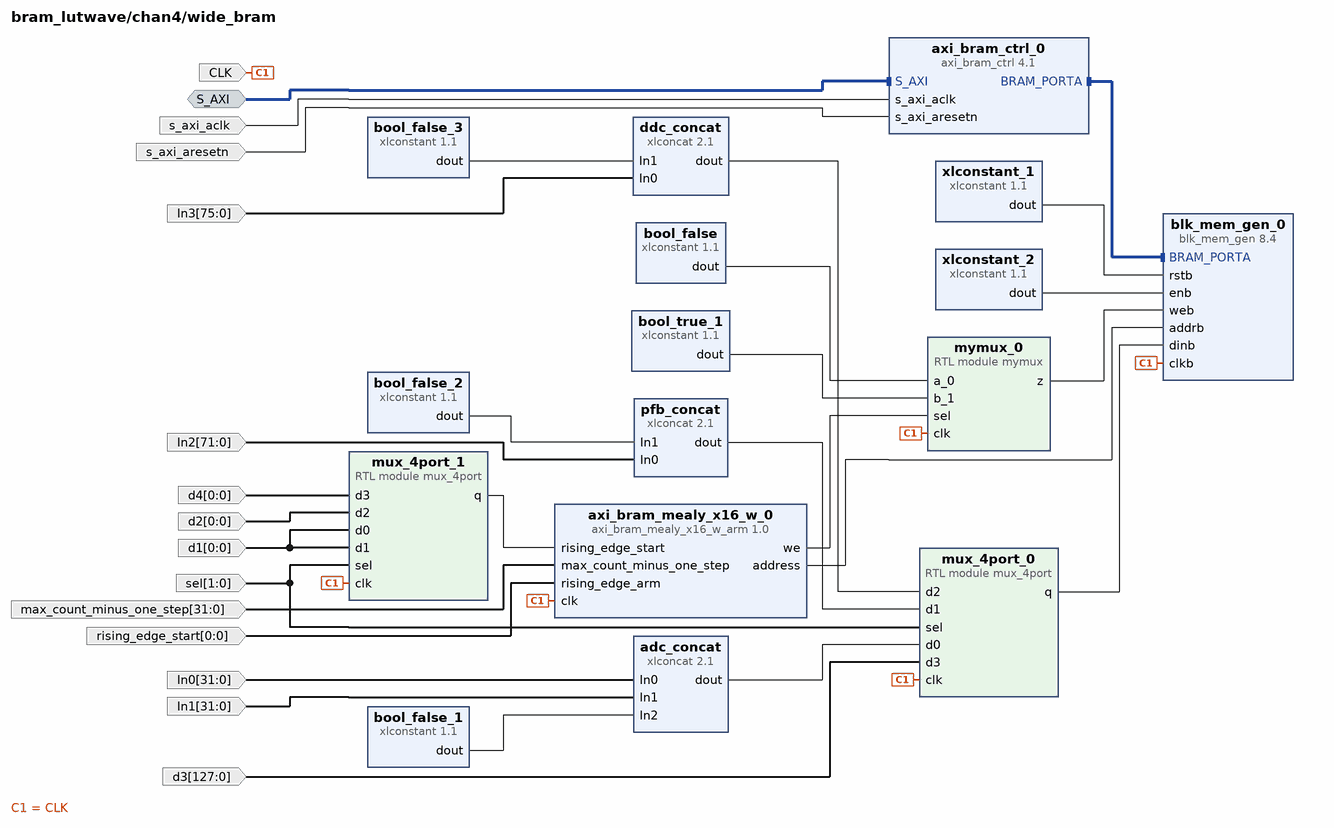
[diagram p29: block diagram inside /chan4/wide_bram]
create_bd_intf_pin -mode Slave -vlnv xilinx.com:interface:aximm_rtl:1.0 S_AXI
create_bd_pin -dir I -type clk s_axi_aclk
create_bd_pin -dir I -type rst s_axi_aresetn
create_bd_pin -dir I -type clk CLK
create_bd_pin -dir I -from 31 -to 0 -type data max_count_minus_one_step
create_bd_pin -dir I -from 0 -to 0 -type data rising_edge_start
create_bd_pin -dir I -from 1 -to 0 sel
create_bd_pin -dir I -from 31 -to 0 In0
create_bd_pin -dir I -from 31 -to 0 In1
create_bd_pin -dir I -from 71 -to 0 In2
create_bd_pin -dir I -from 75 -to 0 In3
create_bd_pin -dir I -from 127 -to 0 d3
create_bd_pin -dir I -from 0 -to 0 d4
create_bd_pin -dir I -from 0 -to 0 d2
create_bd_pin -dir I -from 0 -to 0 d1

create_bd_cell -type ip -vlnv xilinx.com:ip:axi_bram_ctrl:4.1 axi_bram_ctrl_0
set_property -dict {CONFIG.DATA_WIDTH 128 CONFIG.SINGLE_PORT_BRAM 1} [get_bd_cells axi_bram_ctrl_0]
create_bd_cell -type ip -vlnv xilinx.com:ip:xlconstant:1.1 xlconstant_1
set_property -dict {CONFIG.CONST_VAL 0} [get_bd_cells xlconstant_1]
create_bd_cell -type ip -vlnv xilinx.com:ip:xlconstant:1.1 xlconstant_2
set_property -dict {CONFIG.CONST_VAL 1} [get_bd_cells xlconstant_2]
create_bd_cell -type ip -vlnv xilinx.com:ip:blk_mem_gen:8.4 blk_mem_gen_0
set_property -dict [list \
  CONFIG.Enable_32bit_Address true \
  CONFIG.Memory_Type True_Dual_Port_RAM \
  CONFIG.PRIM_type_to_Implement URAM \
  CONFIG.Port_B_Clock 100 \
  CONFIG.Port_B_Enable_Rate 100 \
  CONFIG.Port_B_Write_Rate 50 \
  CONFIG.Use_RSTA_Pin true \
  CONFIG.Use_RSTB_Pin true \
  CONFIG.Write_Depth_A 2048 \
  CONFIG.Write_Width_A 128 \
  CONFIG.use_bram_block Stand_Alone \
] [get_bd_cells blk_mem_gen_0]
create_bd_cell -type ip -vlnv xilinx.com:ip:xlconstant:1.1 bool_false
set_property -dict {CONFIG.CONST_VAL 0 CONFIG.CONST_WIDTH 16} [get_bd_cells bool_false]
create_bd_cell -type ip -vlnv xilinx.com:ip:xlconstant:1.1 bool_true_1
set_property -dict {CONFIG.CONST_VAL 65535 CONFIG.CONST_WIDTH 16} [get_bd_cells bool_true_1]
create_bd_cell -type module -reference mux_4port mux_4port_0
create_bd_cell -type ip -vlnv xilinx.com:ip:xlconcat:2.1 adc_concat
set_property -dict {CONFIG.IN0_WIDTH 32 CONFIG.IN1_WIDTH 32 CONFIG.IN2_WIDTH 64 CONFIG.NUM_PORTS 3} [get_bd_cells adc_concat]
create_bd_cell -type ip -vlnv xilinx.com:ip:xlconstant:1.1 bool_false_1
set_property -dict {CONFIG.CONST_VAL 0 CONFIG.CONST_WIDTH 64} [get_bd_cells bool_false_1]
create_bd_cell -type ip -vlnv xilinx.com:ip:xlconcat:2.1 pfb_concat
set_property -dict {CONFIG.IN0_WIDTH 72 CONFIG.IN1_WIDTH 56 CONFIG.NUM_PORTS 2} [get_bd_cells pfb_concat]
create_bd_cell -type ip -vlnv xilinx.com:ip:xlconstant:1.1 bool_false_2
set_property -dict {CONFIG.CONST_VAL 0 CONFIG.CONST_WIDTH 56} [get_bd_cells bool_false_2]
create_bd_cell -type ip -vlnv xilinx.com:ip:xlconcat:2.1 ddc_concat
set_property -dict {CONFIG.IN0_WIDTH 76 CONFIG.IN1_WIDTH 52 CONFIG.NUM_PORTS 2} [get_bd_cells ddc_concat]
create_bd_cell -type ip -vlnv xilinx.com:ip:xlconstant:1.1 bool_false_3
set_property -dict {CONFIG.CONST_VAL 0 CONFIG.CONST_WIDTH 52} [get_bd_cells bool_false_3]
create_bd_cell -type module -reference mymux mymux_0
set_property -dict {CONFIG.width 16} [get_bd_cells mymux_0]
create_bd_cell -type ip -vlnv User_Company:SysGen:axi_bram_mealy_x16_w_arm:1.0 axi_bram_mealy_x16_w_0
create_bd_cell -type module -reference mux_4port mux_4port_1
set_property -dict {CONFIG.width 1} [get_bd_cells mux_4port_1]

# ---- hierarchy /ethWrapPort0 ----
current_bd_instance /ethWrapPort0
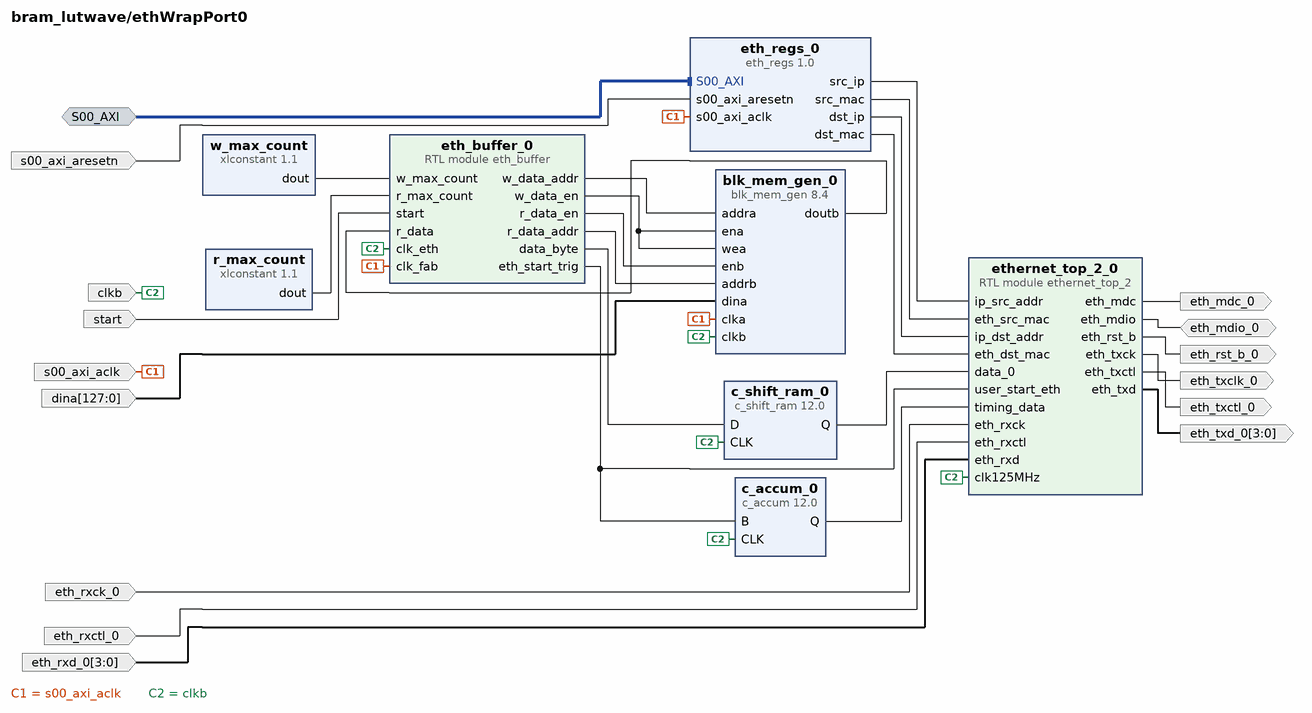
[diagram p30: block diagram inside /ethWrapPort0]
create_bd_intf_pin -mode Slave -vlnv xilinx.com:interface:aximm_rtl:1.0 S00_AXI
create_bd_pin -dir I start
create_bd_pin -dir I -type clk s00_axi_aclk
create_bd_pin -dir I -type clk clkb
create_bd_pin -dir I -from 127 -to 0 dina
create_bd_pin -dir I -type rst s00_axi_aresetn
create_bd_pin -dir O eth_rst_b_0
create_bd_pin -dir O eth_mdc_0
create_bd_pin -dir IO eth_mdio_0
create_bd_pin -dir I eth_rxck_0
create_bd_pin -dir I eth_rxctl_0
create_bd_pin -dir I -from 3 -to 0 eth_rxd_0
create_bd_pin -dir O eth_txclk_0
create_bd_pin -dir O eth_txctl_0
create_bd_pin -dir O -from 3 -to 0 eth_txd_0

create_bd_cell -type module -reference eth_buffer eth_buffer_0
create_bd_cell -type ip -vlnv xilinx.com:ip:xlconstant:1.1 w_max_count
set_property -dict {CONFIG.CONST_VAL 509 CONFIG.CONST_WIDTH 9} [get_bd_cells w_max_count]
create_bd_cell -type ip -vlnv xilinx.com:ip:blk_mem_gen:8.4 blk_mem_gen_0
set_property -dict [list \
  CONFIG.Enable_32bit_Address false \
  CONFIG.Enable_B Use_ENB_Pin \
  CONFIG.Memory_Type Simple_Dual_Port_RAM \
  CONFIG.Operating_Mode_A NO_CHANGE \
  CONFIG.Port_B_Clock 100 \
  CONFIG.Port_B_Enable_Rate 100 \
  CONFIG.Read_Width_B 128 \
  CONFIG.Register_PortB_Output_of_Memory_Primitives true \
  CONFIG.Use_Byte_Write_Enable false \
  CONFIG.Write_Depth_A 512 \
  CONFIG.Write_Width_A 128 \
  CONFIG.Write_Width_B 128 \
  CONFIG.use_bram_block Stand_Alone \
] [get_bd_cells blk_mem_gen_0]
create_bd_cell -type ip -vlnv xilinx.com:ip:xlconstant:1.1 r_max_count
set_property -dict {CONFIG.CONST_VAL 8189 CONFIG.CONST_WIDTH 13} [get_bd_cells r_max_count]
create_bd_cell -type ip -vlnv user.org:user:eth_regs:1.0 eth_regs_0
create_bd_cell -type module -reference ethernet_top_2 ethernet_top_2_0
create_bd_cell -type ip -vlnv xilinx.com:ip:c_shift_ram:12.0 c_shift_ram_0
set_property -dict [list \
  CONFIG.AsyncInitVal 00000000 \
  CONFIG.DefaultData 00000000 \
  CONFIG.Depth 43 \
  CONFIG.Width 8 \
] [get_bd_cells c_shift_ram_0]
create_bd_cell -type ip -vlnv xilinx.com:ip:c_accum:12.0 c_accum_0
set_property -dict [list \
  CONFIG.Bypass false \
  CONFIG.Input_Type Unsigned \
  CONFIG.Input_Width 1 \
  CONFIG.Output_Width 32 \
] [get_bd_cells c_accum_0]

# ---- hierarchy /ethWrapPort1 ----
current_bd_instance /ethWrapPort1
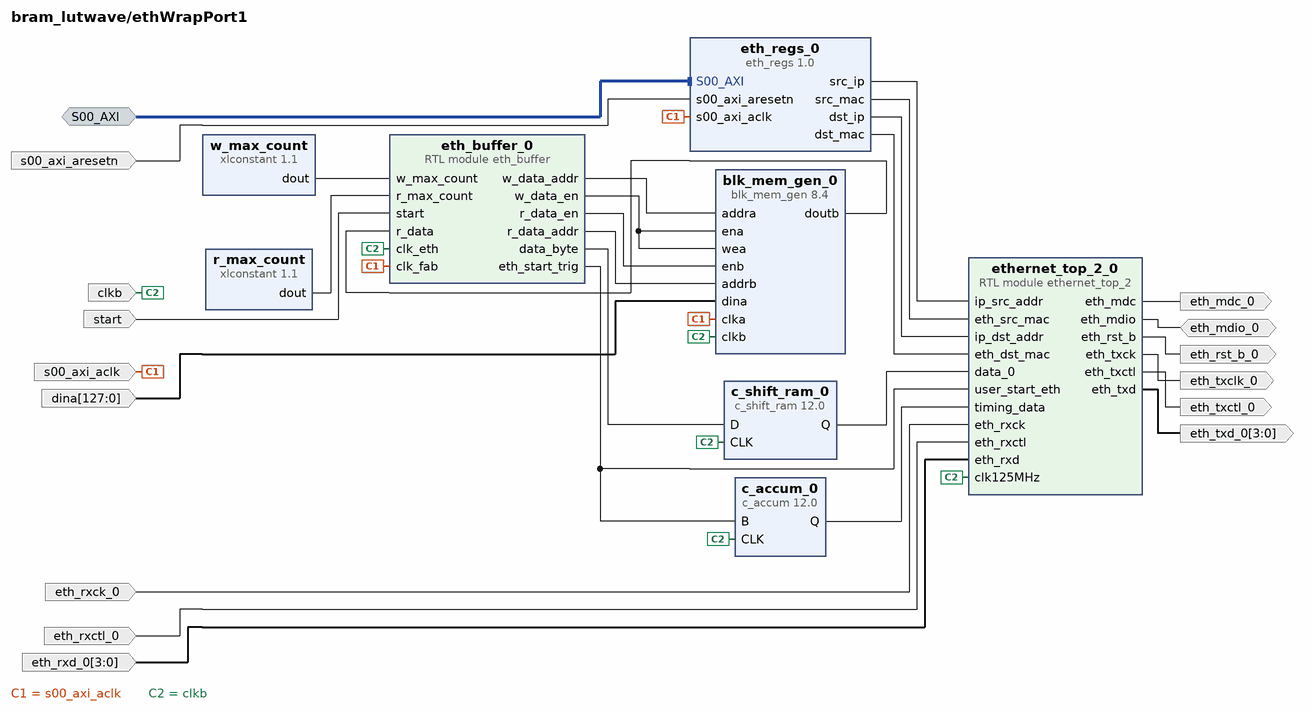
[diagram p31: block diagram inside /ethWrapPort1]
create_bd_intf_pin -mode Slave -vlnv xilinx.com:interface:aximm_rtl:1.0 S00_AXI
create_bd_pin -dir I start
create_bd_pin -dir I -type clk s00_axi_aclk
create_bd_pin -dir I -type clk clkb
create_bd_pin -dir I -from 127 -to 0 dina
create_bd_pin -dir I -type rst s00_axi_aresetn
create_bd_pin -dir O eth_rst_b_0
create_bd_pin -dir O eth_mdc_0
create_bd_pin -dir IO eth_mdio_0
create_bd_pin -dir I eth_rxck_0
create_bd_pin -dir I eth_rxctl_0
create_bd_pin -dir I -from 3 -to 0 eth_rxd_0
create_bd_pin -dir O eth_txclk_0
create_bd_pin -dir O eth_txctl_0
create_bd_pin -dir O -from 3 -to 0 eth_txd_0

create_bd_cell -type module -reference eth_buffer eth_buffer_0
create_bd_cell -type ip -vlnv xilinx.com:ip:xlconstant:1.1 w_max_count
set_property -dict {CONFIG.CONST_VAL 509 CONFIG.CONST_WIDTH 9} [get_bd_cells w_max_count]
create_bd_cell -type ip -vlnv xilinx.com:ip:blk_mem_gen:8.4 blk_mem_gen_0
set_property -dict [list \
  CONFIG.Enable_32bit_Address false \
  CONFIG.Enable_B Use_ENB_Pin \
  CONFIG.Memory_Type Simple_Dual_Port_RAM \
  CONFIG.Operating_Mode_A NO_CHANGE \
  CONFIG.Port_B_Clock 100 \
  CONFIG.Port_B_Enable_Rate 100 \
  CONFIG.Read_Width_B 128 \
  CONFIG.Register_PortB_Output_of_Memory_Primitives true \
  CONFIG.Use_Byte_Write_Enable false \
  CONFIG.Write_Depth_A 512 \
  CONFIG.Write_Width_A 128 \
  CONFIG.Write_Width_B 128 \
  CONFIG.use_bram_block Stand_Alone \
] [get_bd_cells blk_mem_gen_0]
create_bd_cell -type ip -vlnv xilinx.com:ip:xlconstant:1.1 r_max_count
set_property -dict {CONFIG.CONST_VAL 8189 CONFIG.CONST_WIDTH 13} [get_bd_cells r_max_count]
create_bd_cell -type ip -vlnv user.org:user:eth_regs:1.0 eth_regs_0
create_bd_cell -type module -reference ethernet_top_2 ethernet_top_2_0
create_bd_cell -type ip -vlnv xilinx.com:ip:c_shift_ram:12.0 c_shift_ram_0
set_property -dict [list \
  CONFIG.AsyncInitVal 00000000 \
  CONFIG.DefaultData 00000000 \
  CONFIG.Depth 43 \
  CONFIG.Width 8 \
] [get_bd_cells c_shift_ram_0]
create_bd_cell -type ip -vlnv xilinx.com:ip:c_accum:12.0 c_accum_0
set_property -dict [list \
  CONFIG.Bypass false \
  CONFIG.Input_Type Unsigned \
  CONFIG.Input_Width 1 \
  CONFIG.Output_Width 32 \
] [get_bd_cells c_accum_0]

# ---- hierarchy /ethWrapPort2 ----
current_bd_instance /ethWrapPort2
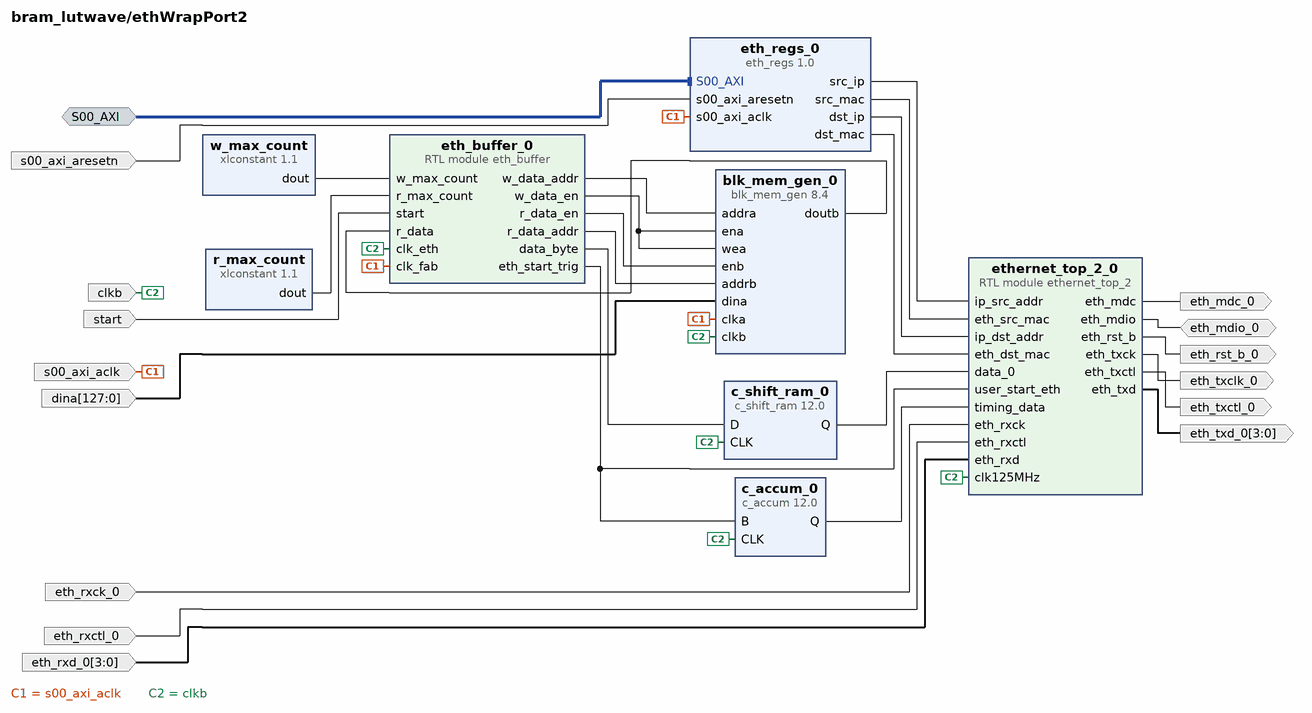
[diagram p32: block diagram inside /ethWrapPort2]
create_bd_intf_pin -mode Slave -vlnv xilinx.com:interface:aximm_rtl:1.0 S00_AXI
create_bd_pin -dir I start
create_bd_pin -dir I -type clk s00_axi_aclk
create_bd_pin -dir I -type clk clkb
create_bd_pin -dir I -from 127 -to 0 dina
create_bd_pin -dir I -type rst s00_axi_aresetn
create_bd_pin -dir O eth_rst_b_0
create_bd_pin -dir O eth_mdc_0
create_bd_pin -dir IO eth_mdio_0
create_bd_pin -dir I eth_rxck_0
create_bd_pin -dir I eth_rxctl_0
create_bd_pin -dir I -from 3 -to 0 eth_rxd_0
create_bd_pin -dir O eth_txclk_0
create_bd_pin -dir O eth_txctl_0
create_bd_pin -dir O -from 3 -to 0 eth_txd_0

create_bd_cell -type module -reference eth_buffer eth_buffer_0
create_bd_cell -type ip -vlnv xilinx.com:ip:xlconstant:1.1 w_max_count
set_property -dict {CONFIG.CONST_VAL 509 CONFIG.CONST_WIDTH 9} [get_bd_cells w_max_count]
create_bd_cell -type ip -vlnv xilinx.com:ip:blk_mem_gen:8.4 blk_mem_gen_0
set_property -dict [list \
  CONFIG.Enable_32bit_Address false \
  CONFIG.Enable_B Use_ENB_Pin \
  CONFIG.Memory_Type Simple_Dual_Port_RAM \
  CONFIG.Operating_Mode_A NO_CHANGE \
  CONFIG.Port_B_Clock 100 \
  CONFIG.Port_B_Enable_Rate 100 \
  CONFIG.Read_Width_B 128 \
  CONFIG.Register_PortB_Output_of_Memory_Primitives true \
  CONFIG.Use_Byte_Write_Enable false \
  CONFIG.Write_Depth_A 512 \
  CONFIG.Write_Width_A 128 \
  CONFIG.Write_Width_B 128 \
  CONFIG.use_bram_block Stand_Alone \
] [get_bd_cells blk_mem_gen_0]
create_bd_cell -type ip -vlnv xilinx.com:ip:xlconstant:1.1 r_max_count
set_property -dict {CONFIG.CONST_VAL 8189 CONFIG.CONST_WIDTH 13} [get_bd_cells r_max_count]
create_bd_cell -type ip -vlnv user.org:user:eth_regs:1.0 eth_regs_0
create_bd_cell -type module -reference ethernet_top_2 ethernet_top_2_0
create_bd_cell -type ip -vlnv xilinx.com:ip:c_accum:12.0 c_accum_0
set_property -dict [list \
  CONFIG.Bypass false \
  CONFIG.Input_Type Unsigned \
  CONFIG.Input_Width 1 \
  CONFIG.Output_Width 32 \
] [get_bd_cells c_accum_0]
create_bd_cell -type ip -vlnv xilinx.com:ip:c_shift_ram:12.0 c_shift_ram_0
set_property -dict [list \
  CONFIG.AsyncInitVal 00000000 \
  CONFIG.DefaultData 00000000 \
  CONFIG.Depth 43 \
  CONFIG.Width 8 \
] [get_bd_cells c_shift_ram_0]

# ---- hierarchy /ethWrapPort3 ----
current_bd_instance /ethWrapPort3
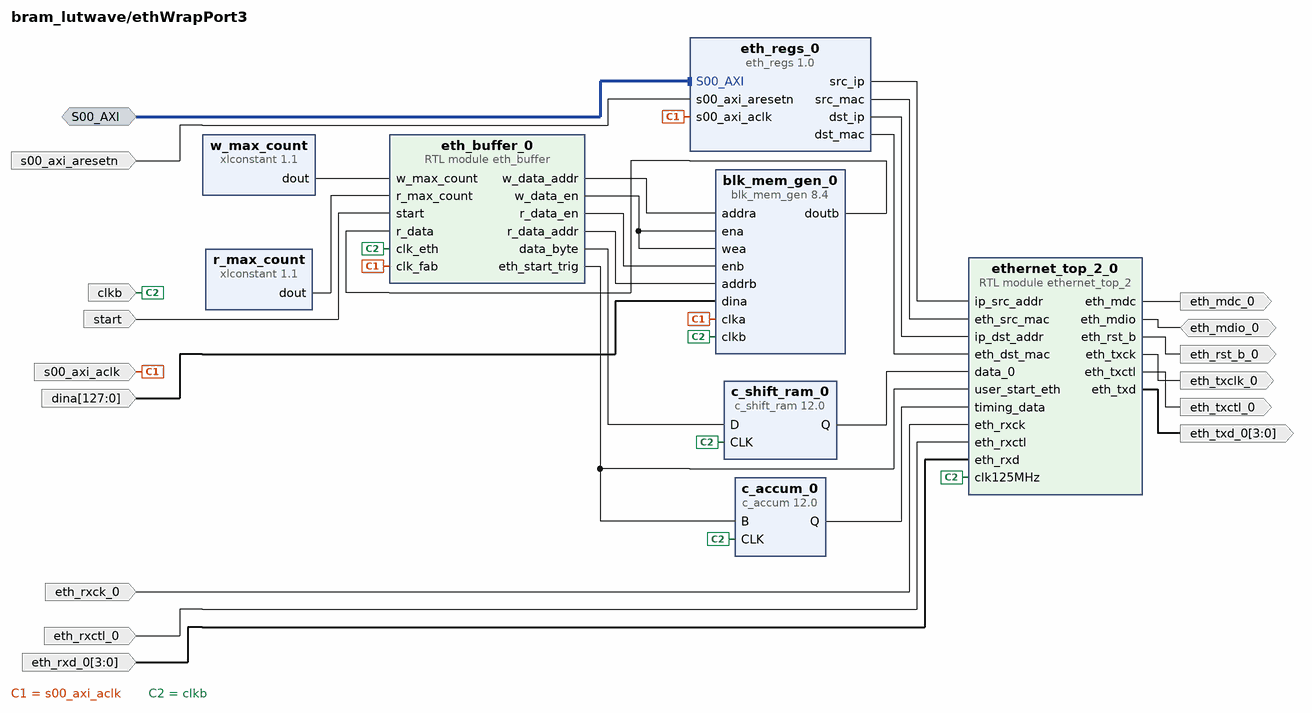
[diagram p33: block diagram inside /ethWrapPort3]
create_bd_intf_pin -mode Slave -vlnv xilinx.com:interface:aximm_rtl:1.0 S00_AXI
create_bd_pin -dir I start
create_bd_pin -dir I -type clk s00_axi_aclk
create_bd_pin -dir I -type clk clkb
create_bd_pin -dir I -from 127 -to 0 dina
create_bd_pin -dir I -type rst s00_axi_aresetn
create_bd_pin -dir O eth_rst_b_0
create_bd_pin -dir O eth_mdc_0
create_bd_pin -dir IO eth_mdio_0
create_bd_pin -dir I eth_rxck_0
create_bd_pin -dir I eth_rxctl_0
create_bd_pin -dir I -from 3 -to 0 eth_rxd_0
create_bd_pin -dir O eth_txclk_0
create_bd_pin -dir O eth_txctl_0
create_bd_pin -dir O -from 3 -to 0 eth_txd_0

create_bd_cell -type module -reference eth_buffer eth_buffer_0
create_bd_cell -type ip -vlnv xilinx.com:ip:xlconstant:1.1 w_max_count
set_property -dict {CONFIG.CONST_VAL 509 CONFIG.CONST_WIDTH 9} [get_bd_cells w_max_count]
create_bd_cell -type ip -vlnv xilinx.com:ip:blk_mem_gen:8.4 blk_mem_gen_0
set_property -dict [list \
  CONFIG.Enable_32bit_Address false \
  CONFIG.Enable_B Use_ENB_Pin \
  CONFIG.Memory_Type Simple_Dual_Port_RAM \
  CONFIG.Operating_Mode_A NO_CHANGE \
  CONFIG.Port_B_Clock 100 \
  CONFIG.Port_B_Enable_Rate 100 \
  CONFIG.Read_Width_B 128 \
  CONFIG.Register_PortB_Output_of_Memory_Primitives true \
  CONFIG.Use_Byte_Write_Enable false \
  CONFIG.Write_Depth_A 512 \
  CONFIG.Write_Width_A 128 \
  CONFIG.Write_Width_B 128 \
  CONFIG.use_bram_block Stand_Alone \
] [get_bd_cells blk_mem_gen_0]
create_bd_cell -type ip -vlnv xilinx.com:ip:xlconstant:1.1 r_max_count
set_property -dict {CONFIG.CONST_VAL 8189 CONFIG.CONST_WIDTH 13} [get_bd_cells r_max_count]
create_bd_cell -type ip -vlnv user.org:user:eth_regs:1.0 eth_regs_0
create_bd_cell -type module -reference ethernet_top_2 ethernet_top_2_0
create_bd_cell -type ip -vlnv xilinx.com:ip:c_accum:12.0 c_accum_0
set_property -dict [list \
  CONFIG.Bypass false \
  CONFIG.Input_Type Unsigned \
  CONFIG.Input_Width 1 \
  CONFIG.Output_Width 32 \
] [get_bd_cells c_accum_0]
create_bd_cell -type ip -vlnv xilinx.com:ip:c_shift_ram:12.0 c_shift_ram_0
set_property -dict [list \
  CONFIG.AsyncInitVal 00000000 \
  CONFIG.DefaultData 00000000 \
  CONFIG.Depth 43 \
  CONFIG.Width 8 \
] [get_bd_cells c_shift_ram_0]

# ---- connections ----

current_bd_instance /chan1
connect_bd_intf_net [get_bd_intf_pins S00_AXI] [get_bd_intf_pins dsp_regs_0/S00_AXI]
connect_bd_intf_net [get_bd_intf_pins S_AXI] [get_bd_intf_pins axi_wide_ctrl/S_AXI]
connect_bd_intf_net [get_bd_intf_pins S_AXI2] [get_bd_intf_pins axi_dphi_bram/S_AXI]
connect_bd_intf_net [get_bd_intf_pins S_AXI1] [get_bd_intf_pins wide_bram/S_AXI]
connect_bd_intf_net [get_bd_intf_pins axi_dphi_bram/BRAM_PORTA] [get_bd_intf_pins blk_mem_gen_0/BRAM_PORTA]
connect_bd_net -net axi_gpio_0_gpio2_io_o [get_bd_pins axi_wide_ctrl/gpio2_io_o] [get_bd_pins xlslice_1/Din] [get_bd_pins xlslice_2/Din]
connect_bd_net [get_bd_pins xlslice_1/Dout] [get_bd_pins wide_bram/rising_edge_start]
connect_bd_net [get_bd_pins xlslice_2/Dout] [get_bd_pins wide_bram/sel]
connect_bd_net -net module_config_splitter_accum_len [get_bd_pins accum_sync/accum_len] [get_bd_pins blast_module_v6_cord_0/accum_len]
connect_bd_net -net module_config_splitter_i1 [get_bd_pins accum_sync/accum_rst] [get_bd_pins blast_module_v6_cord_0/accum_reset]
connect_bd_net -net i_splitter_i0 [get_bd_pins i_adc_splitter/i0] [get_bd_pins blast_module_v6_cord_0/adc_i0]
connect_bd_net -net i_splitter_i1 [get_bd_pins i_adc_splitter/i1] [get_bd_pins blast_module_v6_cord_0/adc_i1]
connect_bd_net -net q_splitter_i0 [get_bd_pins q_adc_splitter/i0] [get_bd_pins blast_module_v6_cord_0/adc_q0]
connect_bd_net -net q_splitter_i1 [get_bd_pins q_adc_splitter/i1] [get_bd_pins blast_module_v6_cord_0/adc_q1]
connect_bd_net -net i2_Dout [get_bd_pins bin_num_slice/Dout] [get_bd_pins blast_module_v6_cord_0/bin_num]
connect_bd_net -net i0_Dout [get_bd_pins dds_shift_slice/Dout] [get_bd_pins blast_module_v6_cord_0/dds_shift]
connect_bd_net -net gpio1_Dout [get_bd_pins fft_shift_slice/Dout] [get_bd_pins blast_module_v6_cord_0/fft_shift]
connect_bd_net -net gpio1_Dout1 [get_bd_pins load_bins_slice/Dout] [get_bd_pins blast_module_v6_cord_0/load_bins]
connect_bd_net [get_bd_pins dsp_regs_0/reg3out] [get_bd_pins dds_shift_slice/Din]
connect_bd_net -net dina_1 [get_bd_pins ddc_concat/dout] [get_bd_pins wide_bram/In3]
connect_bd_net -net axi_gpio_0_gpio_io_o [get_bd_pins axi_wide_ctrl/gpio_io_o] [get_bd_pins wide_bram/max_count_minus_one_step]
connect_bd_net -net Q_concat_dout [get_bd_pins fft_concat/dout] [get_bd_pins wide_bram/In2]
connect_bd_net [get_bd_pins dsp_regs_0/reg1out] [get_bd_pins bin_num_slice/Din]
connect_bd_net -net Din_2 [get_bd_pins dsp_regs_0/reg2out] [get_bd_pins accum_sync/Din]
connect_bd_net -net module_config_splitter_Dout [get_bd_pins accum_sync/sync_in] \
  [get_bd_pins c_counter_binary_0/CE] [get_bd_pins blk_mem_gen_0/enb] [get_bd_pins blast_module_v6_cord_0/start_dac]
connect_bd_net -net clk_wiz_0_clk_out1 [get_bd_pins s00_axi_aclk] \
  [get_bd_pins dsp_regs_0/s00_axi_aclk] [get_bd_pins wide_bram/s_axi_aclk] [get_bd_pins wide_bram/CLK] \
  [get_bd_pins axi_dphi_bram/s_axi_aclk] [get_bd_pins c_counter_binary_0/CLK] [get_bd_pins blk_mem_gen_0/clkb] \
  [get_bd_pins blast_module_v6_cord_0/clk] [get_bd_pins c_shift_ram_0/CLK]
connect_bd_net [get_bd_pins dsp_regs_0/reg0out] [get_bd_pins fft_shift_slice/Din] [get_bd_pins load_bins_slice/Din]
connect_bd_net -net zynq_ultra_ps_e_0_pl_clk0 [get_bd_pins s_axi_aclk] [get_bd_pins axi_wide_ctrl/s_axi_aclk]
connect_bd_net -net rst_ps8_0_99M_peripheral_aresetn [get_bd_pins s_axi_aresetn] [get_bd_pins axi_wide_ctrl/s_axi_aresetn]
connect_bd_net -net rst_ps8_0_99M1_peripheral_aresetn [get_bd_pins s_axi_aresetn1] \
  [get_bd_pins wide_bram/s_axi_aresetn] [get_bd_pins dsp_regs_0/s00_axi_aresetn] [get_bd_pins axi_dphi_bram/s_axi_aresetn]
connect_bd_net -net delay_2_q [get_bd_pins In0] [get_bd_pins wide_bram/In0] [get_bd_pins q_adc_splitter/Din]
connect_bd_net -net In1_1 [get_bd_pins In1] [get_bd_pins wide_bram/In1] [get_bd_pins i_adc_splitter/Din]
connect_bd_net [get_bd_pins c_counter_binary_0/Q] [get_bd_pins blk_mem_gen_0/addrb]
connect_bd_net [get_bd_pins xlconstant_5/dout] [get_bd_pins blk_mem_gen_0/web]
connect_bd_net [get_bd_pins blk_mem_gen_0/doutb] [get_bd_pins even_bin_slice/Din] [get_bd_pins odd_bin_slice/Din]
connect_bd_net [get_bd_pins even_bin_slice/Dout] [get_bd_pins blast_module_v6_cord_0/dphi_even]
connect_bd_net [get_bd_pins odd_bin_slice/Dout] [get_bd_pins blast_module_v6_cord_0/dphi_odd]
connect_bd_net [get_bd_pins blast_module_v6_cord_0/accum_snap_i0] [get_bd_pins accum_concat/In0]
connect_bd_net [get_bd_pins blast_module_v6_cord_0/accum_snap_q0] [get_bd_pins accum_concat/In1]
connect_bd_net [get_bd_pins blast_module_v6_cord_0/accum_snap_i1] [get_bd_pins accum_concat/In2]
connect_bd_net [get_bd_pins blast_module_v6_cord_0/accum_snap_q1] [get_bd_pins accum_concat/In3]
connect_bd_net [get_bd_pins blast_module_v6_cord_0/ddc_snap_i0q0] [get_bd_pins ddc_concat/In0]
connect_bd_net [get_bd_pins blast_module_v6_cord_0/ddc_snap_i1q1] [get_bd_pins ddc_concat/In1]
connect_bd_net [get_bd_pins blast_module_v6_cord_0/accum_snap_sync] [get_bd_pins wide_bram/d4] [get_bd_pins accum_snap_sync]
connect_bd_net [get_bd_pins blast_module_v6_cord_0/ddc_snap_sync] [get_bd_pins wide_bram/d2]
connect_bd_net [get_bd_pins blast_module_v6_cord_0/fft_snap_i0q0] [get_bd_pins fft_concat/In0]
connect_bd_net [get_bd_pins blast_module_v6_cord_0/fft_snap_i1q1] [get_bd_pins fft_concat/In1]
connect_bd_net [get_bd_pins blast_module_v6_cord_0/fft_snap_sync] [get_bd_pins wide_bram/d1]
connect_bd_net [get_bd_pins xlconstant_6/dout] [get_bd_pins blk_mem_gen_0/rstb]
connect_bd_net [get_bd_pins xlconstant_7/dout] [get_bd_pins blk_mem_gen_0/dinb]
connect_bd_net [get_bd_pins accum_concat/dout] [get_bd_pins c_shift_ram_0/D]
connect_bd_net [get_bd_pins c_shift_ram_0/Q] [get_bd_pins wide_bram/d3] [get_bd_pins Q]
